# Altium project new.PrjPCB
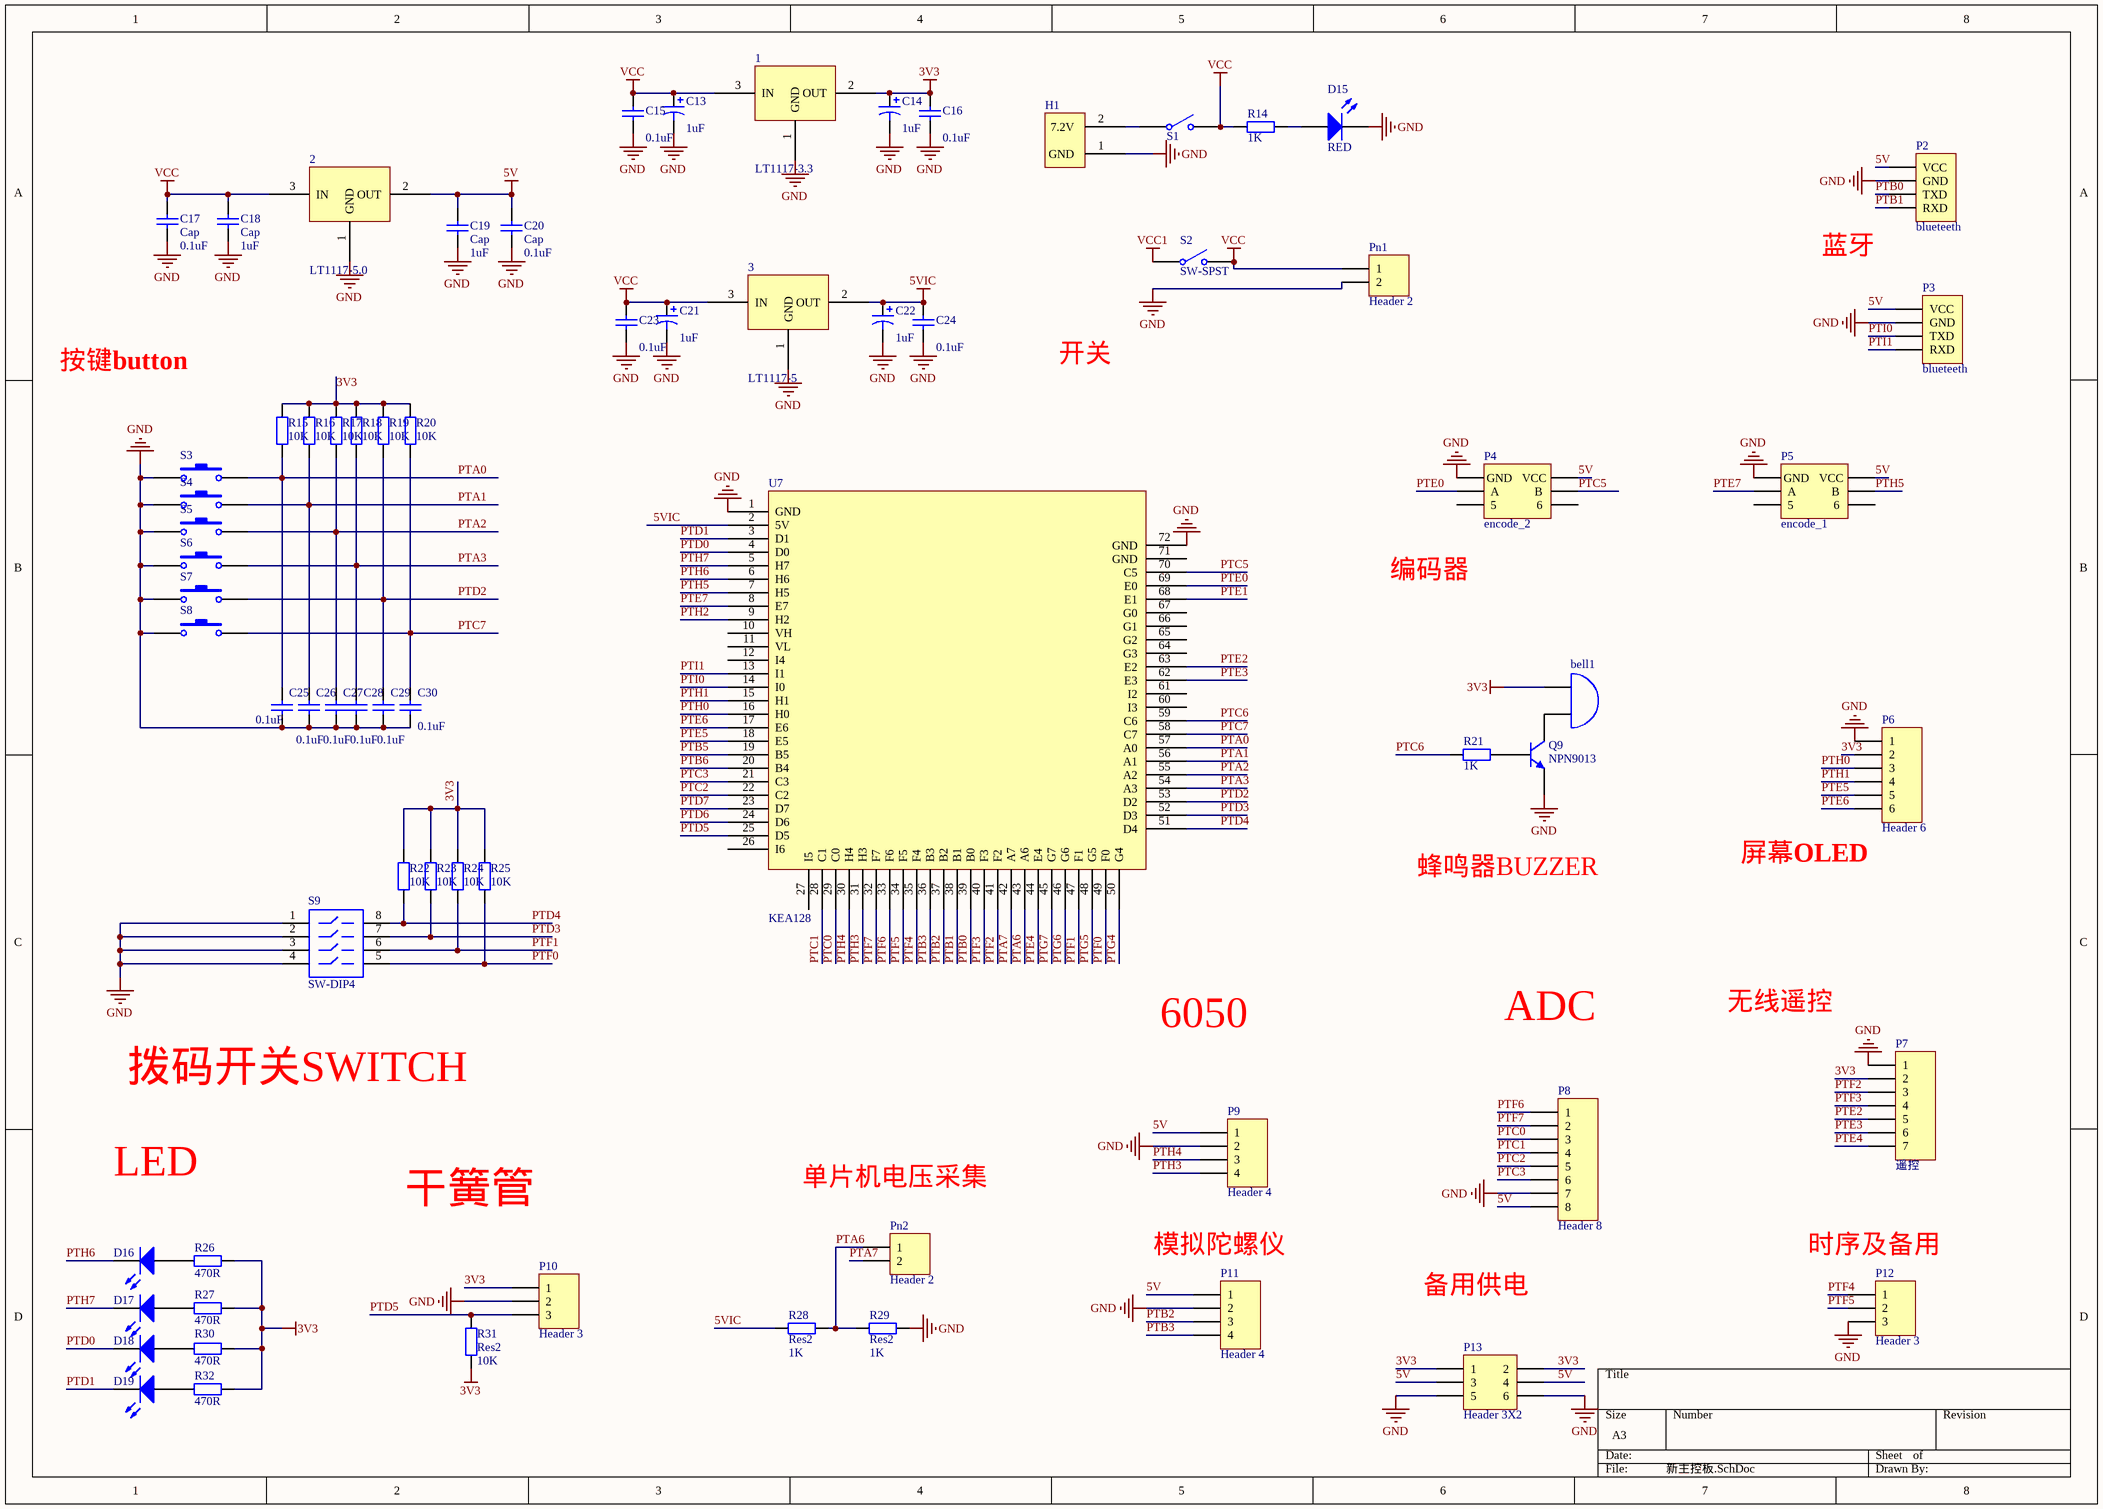
[diagram p0: 新主控板.SchDoc]
2 sheets, 128 parts. Net scope: global (net labels, ports and power ports of the same name join across sheets).
Board file: new.PcbDoc
Sheets:
  新主控板.SchDoc
  mos motor.SchDoc

## Sheet 新主控板.SchDoc
size A3

### Parts
1  LT1117-3.3  [1117]
2  LT1117-5.0  [1117]
3  LT1117-5  [1117]
bell1  Bell  [470uF]  (value not drawn)
C13  value 1uF  [0805(2012)]  (hidden comment: Cap Pol1)
C14  value 1uF  [0805(2012)]  (hidden comment: Cap Pol1)
C15  value 0.1uF  [0805(2012)]  (hidden comment: Cap)
C16  value 0.1uF  [0805(2012)]  (hidden comment: Cap)
C17  Cap  value 0.1uF  [0805(2012)]
C18  Cap  value 1uF  [0805(2012)]
C19  Cap  value 1uF  [0805(2012)]
C20  Cap  value 0.1uF  [0805(2012)]
C21  value 1uF  [0805(2012)]  (hidden comment: Cap Pol1)
C22  value 1uF  [0805(2012)]  (hidden comment: Cap Pol1)
C23  value 0.1uF  [0805(2012)]  (hidden comment: Cap)
C24  value 0.1uF  [0805(2012)]  (hidden comment: Cap)
C25  value 0.1uF  [0805(2012)]  (hidden comment: Cap)
C26  value 0.1uF  [0805(2012)]  (hidden comment: Cap)
C27  value 0.1uF  [0805(2012)]  (hidden comment: Cap)
C28  value 0.1uF  [0805(2012)]  (hidden comment: Cap)
C29  value 0.1uF  [0805(2012)]  (hidden comment: Cap)
C30  value 0.1uF  [0805(2012)]  (hidden comment: Cap)
D15  RED  [0805LED]
D16  LED0  [0805LED]  (value not drawn)
D17  LED0  [0805LED]  (value not drawn)
D18  LED0  [0805LED]  (value not drawn)
D19  LED0  [0805LED]  (value not drawn)
H1  H1  [KF301-2P]  (value not drawn)
P2  blueteeth  [HDR1X4]
P3  blueteeth  [HDR1X4]
P4  encode_2  [HDR2X3]
P5  encode_1  [HDR2X3]
P6  Header 6  [HDR1X6]
P7  遥控  [HDR1X7]
P8  Header 8  [HDR1X8]
P9  Header 4  [HDR1X4]
P10  Header 3  [HDR1X3]
P11  Header 4  [HDR1X4]
P12  Header 3  [HDR1X3]
P13  Header 3X2  [HDR2X3]
Pn1  Header 2  [HDR1X2]
Pn2  Header 2  [HDR1X2]
Q9  NPN9013  [TO-226-AE]
R14  value 1K  [0805(2012)]  (hidden comment: Res2)
R15  value 10K  [0805(2012)]  (hidden comment: Res2)
R16  value 10K  [0805(2012)]  (hidden comment: Res2)
R17  value 10K  [0805(2012)]  (hidden comment: Res2)
R18  value 10K  [0805(2012)]  (hidden comment: Res2)
R19  value 10K  [0805(2012)]  (hidden comment: Res2)
R20  value 10K  [0805(2012)]  (hidden comment: Res2)
R21  value 1K  [0805(2012)]  (hidden comment: Res2)
R22  value 10K  [0805(2012)]  (hidden comment: Res2)
R23  value 10K  [0805(2012)]  (hidden comment: Res2)
R24  value 10K  [0805(2012)]  (hidden comment: Res2)
R25  value 10K  [0805(2012)]  (hidden comment: Res2)
R26  value 470R  [0805(2012)]  (hidden comment: Res2)
R27  value 470R  [0805(2012)]  (hidden comment: Res2)
R28  Res2  value 1K  [0805(2012)]
R29  Res2  value 1K  [0805(2012)]
R30  value 470R  [0805(2012)]  (hidden comment: Res2)
R31  Res2  value 10K  [0805(2012)]
R32  value 470R  [0805(2012)]  (hidden comment: Res2)
S1  SW-SPST  [SWICH_3]  (value not drawn)
S2  SW-SPST  [SWICH_3]
S3  SW-PB  [PCBComponent_1]  (value not drawn)
S4  SW-PB  [PCBComponent_1]  (value not drawn)
S5  SW-PB  [PCBComponent_1]  (value not drawn)
S6  SW-PB  [PCBComponent_1]  (value not drawn)
S7  SW-PB  [PCBComponent_1]  (value not drawn)
S8  SW-PB  [PCBComponent_1]  (value not drawn)
S9  SW-DIP4  [DIP-8]
U7  KEA128  [KEA128_BOARD]

### Nets
3V3: 1.2(OUT) bell1.1(A) C14.1 C16.2 P6.2 P7.2 P10.1 P13.1 P13.2 R15.2 R16.2 R17.2 R18.2 R19.2 R20.2 R22.2 R23.2 R24.2 R25.2 R26.2 R27.2 R30.2 R31.1 R32.2
5V: 2.2(OUT) C19.2 C20.2 P2.1(VCC) P3.1(VCC) P4.2(VCC) P5.2(VCC) P8.8 P9.1 P11.1 P13.3 P13.4
5VIC: 3.2(OUT) C22.1 C24.2 R28.1 U7.2(5V)
GND: 1.1(GND) 2.1(GND) 3.1(GND) C13.2 C14.2 C15.1 C16.1 C17.1 C18.1 C19.1 C20.1 C21.2 C22.2 C23.1 C24.1 C25.1 C26.1 C27.1 C28.1 C29.1 C30.1 D15.2(K) H1.1(GND) P2.2(GND) P3.2(GND) P4.1(GND) P5.1(GND) P6.1 P7.1 P8.7 P9.2 P10.2 P11.2 P12.3 P13.5 P13.6 Pn1.2 Q9.1(E) R29.2 S3.1 S4.1 S5.1 S6.1 S7.1 S8.1 S9.1 S9.2 S9.3 S9.4 U7.1(GND) U7.72(GND)
VCC: 1.3(IN) 2.3(IN) 3.3(IN) C13.1 C15.2 C17.2 C18.2 C21.1 C23.2 Pn1.1 R14.2 S1.2(NO) S2.2(NO)
VCC1: S2.1(COMMON)  [project net Vbat]
PTA0: C25.2 R15.1 S3.2 U7.57(A0)
PTA1: C26.2 R16.1 S4.2 U7.56(A1)
PTA2: C27.2 R17.1 S5.2 U7.55(A2)
PTA3: C28.2 R18.1 S6.2 U7.54(A3)
PTA6: Pn2.1 R28.2 R29.1 U7.43(A6)
PTA7: Pn2.2 U7.42(A7)
PTB0: P2.3(TXD) U7.39(B0)
PTB1: P2.4(RXD) U7.38(B1)
PTB2: P11.3 U7.37(B2)
PTB3: P11.4 U7.36(B3)
PTB5: U7.19(B5)
PTB6: U7.20(B4)
PTC0: P8.3 U7.29(C0)
PTC1: P8.4 U7.28(C1)
PTC2: P8.5 U7.22(C2)
PTC3: P8.6 U7.21(C3)
PTC5: P4.4(B) U7.70(C5)
PTC6: R21.1 U7.59(C6)
PTC7: C30.2 R20.1 S8.2 U7.58(C7)
PTD0: D18.2(K) U7.4(D0)
PTD1: D19.2(K) U7.3(D1)
PTD2: C29.2 R19.1 S7.2 U7.53(D2)
PTD3: R23.1 S9.7 U7.52(D3)
PTD4: R22.1 S9.8 U7.51(D4)
PTD5: P10.3 R31.2 U7.25(D5)
PTD6: U7.24(D6)
PTD7: U7.23(D7)
PTE0: P4.3(A) U7.69(E0)
PTE1: U7.68(E1)
PTE2: P7.5 U7.63(E2)
PTE3: P7.6 U7.62(E3)
PTE4: P7.7 U7.44(E4)
PTE5: P6.5 U7.18(E5)
PTE6: P6.6 U7.17(E6)
PTE7: P5.3(A) U7.8(E7)
PTF0: R25.1 S9.5 U7.49(F0)
PTF1: R24.1 S9.6 U7.47(F1)
PTF2: P7.3 U7.41(F2)
PTF3: P7.4 U7.40(F3)
PTF4: P12.1 U7.35(F4)
PTF5: P12.2 U7.34(F5)
PTF6: P8.1 U7.33(F6)
PTF7: P8.2 U7.32(F7)
PTG4: U7.50(G4)
PTG5: U7.48(G5)
PTG6: U7.46(G6)
PTG7: U7.45(G7)
PTH0: P6.3 U7.16(H0)
PTH1: P6.4 U7.15(H1)
PTH2: U7.9(H2)
PTH3: P9.4 U7.31(H3)
PTH4: P9.3 U7.30(H4)
PTH5: P5.4(B) U7.7(H5)
PTH6: D16.2(K) U7.6(H6)
PTH7: D17.2(K) U7.5(H7)
PTI0: P3.3(TXD) U7.14(I0)
PTI1: P3.4(RXD) U7.13(I1)
Netbell1_2: bell1.2(B) Q9.3(C)
NetD15_1: D15.1(A) R14.1
NetD16_1: D16.1(A) R26.1
NetD17_1: D17.1(A) R27.1
NetD18_1: D18.1(A) R30.1
NetD19_1: D19.1(A) R32.1
NetH1_2: H1.2(7.2V) S1.1(COMMON)
NetQ9_2: Q9.2(B) R21.2

Not connected (* = marked no-connect by the designer): P4 5 6; P5 5 6; U7 10(VH) 11(VL) 12(I4) 26(I6) 27(I5) 60(I3) 61(I2) 64(G3) 65(G2) 66(G1) 67(G0) 71(GND)

### Notes on the sheet
- 蓝牙
- 按键button
- 开关
- 编码器
- 蜂鸣器BUZZER
- 屏幕OLED
- 6050
- ADC
- 无线遥控
- 拨码开关SWITCH
- LED
- 单片机电压采集
- 干簧管
- (near P11) 模拟陀螺仪
- (near P12) 时序及备用
- 备用供电

### Library data of the parts
2 3 = LT1117-3.3
bell1 = Bell: Electrical Bell; Published: 24-Mar-1999; LatestRevisionDate: 17-Jul-2002; LatestRevisionNote: Re-released for DXP Platform.; PackageReference: PIN2; Publisher: Altium Limited
C13 C14 C21 C22 = Cap Pol1: Polarized Capacitor (Radial); Published: 8-Jun-2000; LatestRevisionDate: 17-Jul-2002; LatestRevisionNote: Re-released for DXP Platform.; PackageReference: RB7.6-15; Publisher: Altium Limited; PackageDescription: Polarized Capacitor (Radial); 2 Leads
C15-C20 C23-C30 = Cap: Capacitor; Published: 8-Jun-2000; LatestRevisionDate: 17-Jul-2002; LatestRevisionNote: Re-released for DXP Platform.; PackageReference: RAD-0.3; Publisher: Altium Limited; PackageDescription: Radial Cap, Thru-Hole; 2 Leads; 0.3 in Pin Spacing
D15 = LED2: Typical RED, GREEN, YELLOW, AMBER GaAs LED; Published: 8-Jun-2000; LatestRevisionDate: 17-Jul-2002; LatestRevisionNote: Re-released for DXP Platform.; PackageVersion: Feb-2002; PackageReference: 3.2X1.6X1.1; Publisher: Altium Limited; PackageDescription: SM LED; 2 Flat Leads
D16-D19 = LED0: Typical INFRARED GaAs LED; Published: 8-Jun-2000; LatestRevisionDate: 08-Jul-2005; LatestRevisionNote: Mech Layer 1 removed.; PackageReference: LED-0; Publisher: Altium Limited; PackageDescription: LED; 2 Leads
P4 P5 = encode
P6 = Header 6: Header, 6-Pin; LatestRevisionDate: 17-Jul-2002; LatestRevisionNote: Re-released for DXP Platform.; Publisher: Altium Limited
P7 = MHDR1X7: Header, 7-Pin; LatestRevisionDate: 17-Jul-2002; LatestRevisionNote: Re-released for DXP Platform.; Publisher: Altium Limited
P8 = Header 8: Header, 8-Pin; LatestRevisionDate: 17-Jul-2002; LatestRevisionNote: Re-released for DXP Platform.; Publisher: Altium Limited
P9 P11 = Header 4: Header, 4-Pin; LatestRevisionDate: 17-Jul-2002; LatestRevisionNote: Re-released for DXP Platform.; Publisher: Altium Limited
P10 P12 = Header 3: Header, 3-Pin; LatestRevisionDate: 17-Jul-2002; LatestRevisionNote: Re-released for DXP Platform.; Publisher: Altium Limited
P13 = Header 3X2: Header, 3-Pin, Dual row; LatestRevisionDate: 17-Jul-2002; LatestRevisionNote: Re-released for DXP Platform.; Publisher: Altium Limited
Pn1 Pn2 = Header 2: Header, 2-Pin; LatestRevisionDate: 17-Jul-2002; LatestRevisionNote: Re-released for DXP Platform.; Publisher: Altium Limited
Q9 = 2N3904: NPN General Purpose Amplifier; Published: 8-Jun-2000; LatestRevisionDate: 15-Jan-2003; LatestRevisionNote: PCB Footprint 'BCY-W3/D4.7' replaced; DatasheetVersion: 1997; PackageVersion: Sep-1998; PackageReference: TO-92A; Publisher: Altium Limited; PackageDescription: TO, Flat Index; 3 In-Line, Axial Leads; Body Dia. 4.5mm; Leads 0.51 x 0.48 mm (max); ComponentLink1Description: Manufacturer Link; ComponentLink1URL: http://www.fairchildsemi.com/; ComponentLink2Description: Datasheet; ComponentLink2URL: http://www.fairchildsemi.com/ds/2N%2F2N3904.pdf
R14-R32 = Res2: Resistor; Published: 8-Jun-2000; LatestRevisionDate: 17-Jul-2002; LatestRevisionNote: Re-released for DXP Platform.; PackageReference: AXIAL-0.4; Publisher: Altium Limited; PackageDescription: Axial Device, Thru-Hole; 2 Leads; 0.4 in Pin Spacing
S1 S2 = SW-SPST: Single-Pole, Single-Throw Switch; Published: 24-Mar-1999; LatestRevisionDate: 17-Jul-2002; LatestRevisionNote: Re-released for DXP Platform.; PackageReference: SPST-2; Publisher: Altium Limited; PackageDescription: Switch; 2 Leads
S3-S8 = SW-PB: Switch; Published: 24-Mar-1999; LatestRevisionDate: 17-Jul-2002; LatestRevisionNote: Re-released for DXP Platform.; PackageReference: SPST-2; Publisher: Altium Limited; PackageDescription: Switch; 2 Leads
S9 = SW-DIP4: DIP Switch; Published: 24-Mar-1999; LatestRevisionDate: 17-Jul-2002; LatestRevisionNote: Re-released for DXP Platform.; PackageReference: DIP-8; Publisher: Altium Limited

## Sheet mos motor.SchDoc
size A3
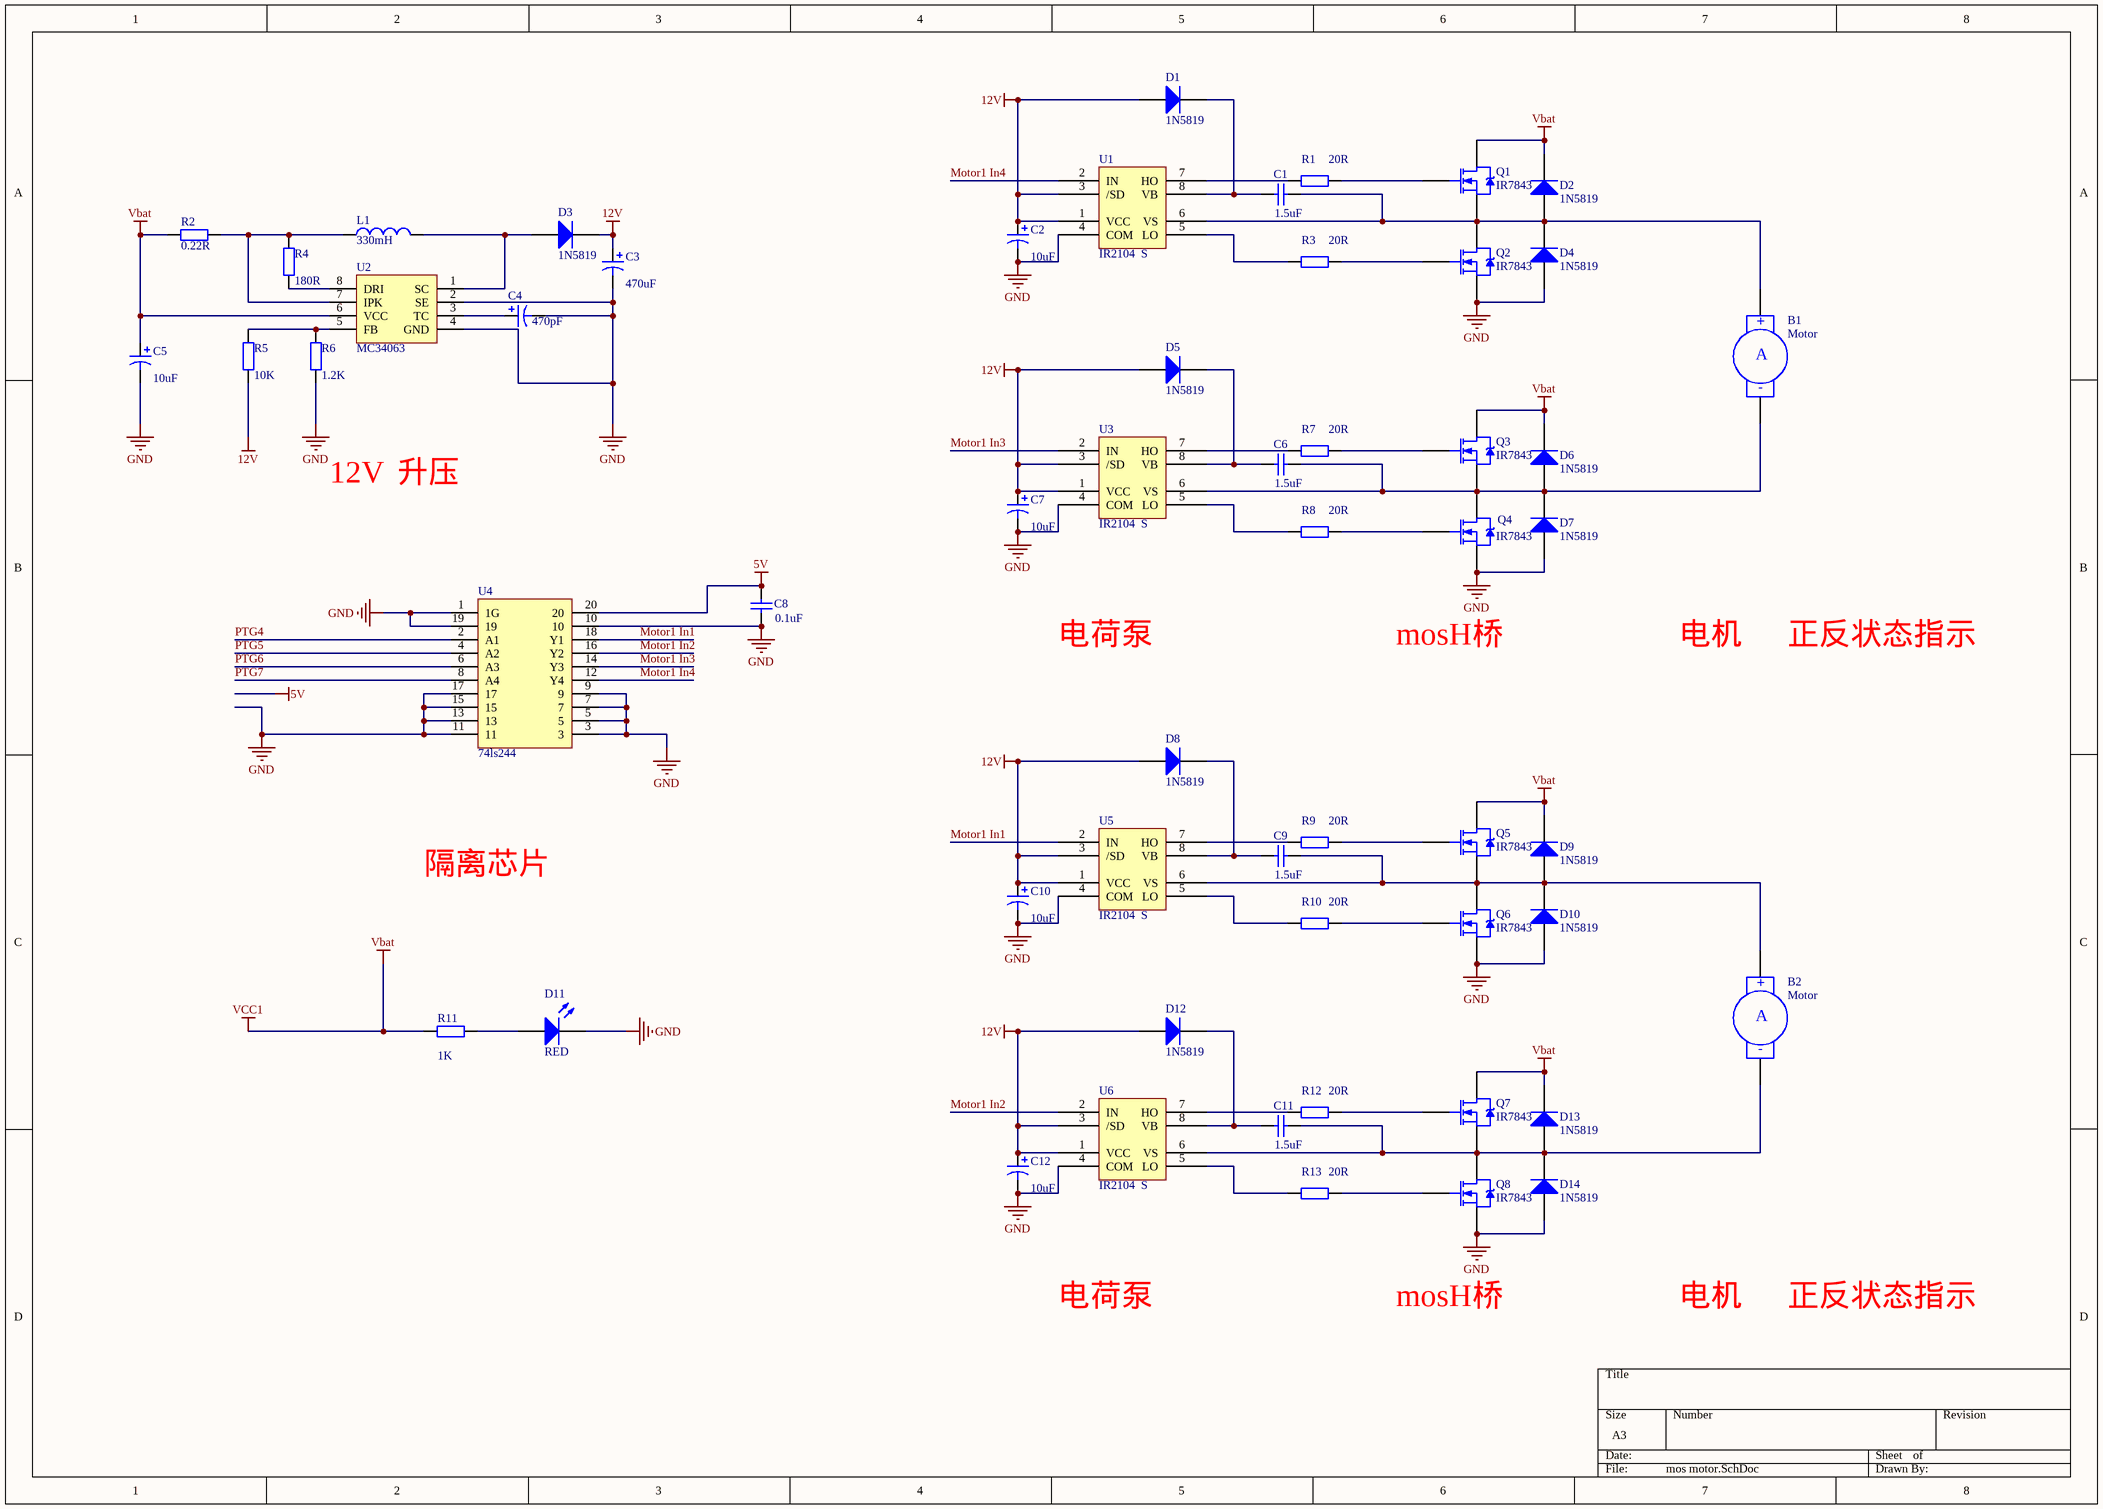
[diagram p1: mos motor.SchDoc]

### Parts
B1  Motor  [KF301-2P]
B2  Motor  [KF301-2P]
C1  value 1.5uF  [0805(2012)]  (hidden comment: Cap)
C2  value 10uF  [SOD-323(0805)]  (hidden comment: Cap Pol1)
C3  value 470uF  [RB5-10.5]  (hidden comment: Cap Pol1)
C4  value 470pF  [SOD-323(0805)]  (hidden comment: Cap Pol1)
C5  value 10uF  [SOD-323(0805)]  (hidden comment: Cap Pol1)
C6  value 1.5uF  [0805(2012)]  (hidden comment: Cap)
C7  value 10uF  [SOD-323(0805)]  (hidden comment: Cap Pol1)
C8  value 0.1uF  [0805(2012)]  (hidden comment: Cap)
C9  value 1.5uF  [0805(2012)]  (hidden comment: Cap)
C10  value 10uF  [SOD-323(0805)]  (hidden comment: Cap Pol1)
C11  value 1.5uF  [0805(2012)]  (hidden comment: Cap)
C12  value 10uF  [SOD-323(0805)]  (hidden comment: Cap Pol1)
D1  1N5819  [0805(2012)]
D2  1N5819  [0805(2012)]
D3  1N5819  [0805(2012)]
D4  1N5819  [0805(2012)]
D5  1N5819  [0805(2012)]
D6  1N5819  [0805(2012)]
D7  1N5819  [0805(2012)]
D8  1N5819  [0805(2012)]
D9  1N5819  [0805(2012)]
D10  1N5819  [0805(2012)]
D11  RED  [0805LED]
D12  1N5819  [0805(2012)]
D13  1N5819  [0805(2012)]
D14  1N5819  [0805(2012)]
L1  value 330mH  [电感10*12]  (hidden comment: Inductor)
Q1  IR7843  [LR7843]
Q2  IR7843  [LR7843]
Q3  IR7843  [LR7843]
Q4  IR7843  [LR7843]
Q5  IR7843  [LR7843]
Q6  IR7843  [LR7843]
Q7  IR7843  [LR7843]
Q8  IR7843  [LR7843]
R1  value 20R  [0805(2012)]  (hidden comment: Res2)
R2  value 0.22R  [1206(3216)]  (hidden comment: Res2)
R3  value 20R  [0805(2012)]  (hidden comment: Res2)
R4  value 180R  [0805(2012)]  (hidden comment: Res2)
R5  value 10K  [0805(2012)]  (hidden comment: Res2)
R6  value 1.2K  [0805(2012)]  (hidden comment: Res2)
R7  value 20R  [0805(2012)]  (hidden comment: Res2)
R8  value 20R  [0805(2012)]  (hidden comment: Res2)
R9  value 20R  [0805(2012)]  (hidden comment: Res2)
R10  value 20R  [0805(2012)]  (hidden comment: Res2)
R11  value 1K  [0805(2012)]  (hidden comment: Res2)
R12  value 20R  [0805(2012)]  (hidden comment: Res2)
R13  value 20R  [0805(2012)]  (hidden comment: Res2)
U1  IR2104  S  [IR2104S]
U2  MC34063  [MC34063]
U3  IR2104  S  [IR2104S]
U4  74ls244  [74ls244Da]
U5  IR2104  S  [IR2104S]
U6  IR2104  S  [IR2104S]

### Nets
5V: C8.2 U4.20
12V: C2.1 C3.1 C7.1 C10.1 C12.1 D1.2(A) D3.1(K) D5.2(A) D8.2(A) D12.2(A) R5.1 U1.1(VCC) U1.3(/SD) U3.1(VCC) U3.3(/SD) U5.1(VCC) U5.3(/SD) U6.1(VCC) U6.3(/SD)
GND: C2.2 C3.2 C4.2 C5.2 C7.2 C8.1 C10.2 C12.2 D4.2(A) D7.2(A) D10.2(A) D11.2(K) D14.2(A) Q2.3(S) Q4.3(S) Q6.3(S) Q8.3(S) R6.1 U1.4(COM) U2.2(SE) U2.4(GND) U3.4(COM) U4.1(1G) U4.3 U4.5 U4.7 U4.9 U4.10 U4.11 U4.13 U4.15 U4.17 U4.19 U5.4(COM) U6.4(COM)
Vbat: C5.1 D2.1(K) D6.1(K) D9.1(K) D13.1(K) Q1.2(D) Q3.2(D) Q5.2(D) Q7.2(D) R2.2 R11.1 U2.6(VCC)  [also labelled VCC1]
Motor1 In1: U4.18(Y1) U5.2(IN)
Motor1 In2: U4.16(Y2) U6.2(IN)
Motor1 In3: U3.2(IN) U4.14(Y3)
Motor1 In4: U1.2(IN) U4.12(Y4)
PTG4: U4.2(A1)
PTG5: U4.4(A2)
PTG6: U4.6(A3)
PTG7: U4.8(A4)
NetB1_1: B1.1(+) C1.2 D2.2(A) D4.1(K) Q1.3(S) Q2.2(D) U1.6(VS)
NetB1_2: B1.2(-) C6.2 D6.2(A) D7.1(K) Q3.3(S) Q4.2(D) U3.6(VS)
NetB2_1: B2.1(+) C9.2 D9.2(A) D10.1(K) Q5.3(S) Q6.2(D) U5.6(VS)
NetB2_2: B2.2(-) C11.2 D13.2(A) D14.1(K) Q7.3(S) Q8.2(D) U6.6(VS)
NetC1_1: C1.1 D1.1(K) U1.8(VB)
NetC4_1: C4.1 U2.3(TC)
NetC6_1: C6.1 D5.1(K) U3.8(VB)
NetC9_1: C9.1 D8.1(K) U5.8(VB)
NetC11_1: C11.1 D12.1(K) U6.8(VB)
NetD3_2: D3.2(A) L1.2 U2.1(SC)
NetD11_1: D11.1(A) R11.2
NetL1_1: L1.1 R2.1 R4.2 U2.7(IPK)
NetQ1_1: Q1.1(G) R1.2
NetQ2_1: Q2.1(G) R3.2
NetQ3_1: Q3.1(G) R7.2
NetQ4_1: Q4.1(G) R8.2
NetQ5_1: Q5.1(G) R9.2
NetQ6_1: Q6.1(G) R10.2
NetQ7_1: Q7.1(G) R12.2
NetQ8_1: Q8.1(G) R13.2
NetR1_1: R1.1 U1.7(HO)
NetR3_1: R3.1 U1.5(LO)
NetR4_1: R4.1 U2.8(DRI)
NetR5_2: R5.2 R6.2 U2.5(FB)
NetR7_1: R7.1 U3.7(HO)
NetR8_1: R8.1 U3.5(LO)
NetR9_1: R9.1 U5.7(HO)
NetR10_1: R10.1 U5.5(LO)
NetR12_1: R12.1 U6.7(HO)
NetR13_1: R13.1 U6.5(LO)

### Notes on the sheet
- 12V
- 升压
- 电荷泵
- mosH桥
- 电机
- 正反状态指示
- 隔离芯片
- (in symbol Motor Servo) A

### Library data of the parts
B1 B2 = Motor Servo: Servo Motor; Published: 24-Mar-1999; LatestRevisionDate: 17-Jul-2002; LatestRevisionNote: Re-released for DXP Platform.; PackageReference: RAD-0.4; Publisher: Altium Limited; PackageDescription: Radial Cap, Thru-Hole; 2 Leads; 0.4 in Pin Spacing
C1 C6 C8 C9 C11 = Cap: Capacitor; Published: 8-Jun-2000; LatestRevisionDate: 17-Jul-2002; LatestRevisionNote: Re-released for DXP Platform.; PackageReference: RAD-0.3; Publisher: Altium Limited; PackageDescription: Radial Cap, Thru-Hole; 2 Leads; 0.3 in Pin Spacing
C2-C5 C7 C10 C12 = Cap Pol1: Polarized Capacitor (Radial); Published: 8-Jun-2000; LatestRevisionDate: 17-Jul-2002; LatestRevisionNote: Re-released for DXP Platform.; PackageReference: RB7.6-15; Publisher: Altium Limited; PackageDescription: Polarized Capacitor (Radial); 2 Leads
D1-D10 D12-D14 = 1N4148: Silicon Epitaxial Planar Diode for Various Detector, Modulator, Demodulator; Published: 12-Feb-2010; DatasheetVersion: Rev.5.00, Jul-2006; PackageVersion: Aug-2005; PackageReference: GRZZ0002ZB-A; Publisher: Altium Limited; PackageDescription: Diode, Axial; Body 4.2 x 2.0 mm (LxDia.), Lead Dia. 0.5 mm (nom); Code_JEITA: SC-40; ComponentLink1Description: Manufacturer Link; ComponentLink1URL: http://sg.renesas.com/fmwk.jsp?cnt=diode_landing.jsp&fp=/products/discrete/diodes/; ComponentLink2Description: Datasheet; ComponentLink2URL: http://documentation.renesas.com/eng/products/diode/rej03g0556_1n4148.pdf; ComponentLink3Description: Packaging Specification; ComponentLink3URL: http://sg.renesas.com/media/products/common_info/package/pdf/diode/code/grzz0002zb_a.pdf
D11 = LED2: as D15 on sheet 新主控板; Published: 8-Jun-2000; LatestRevisionDate: 17-Jul-2002; LatestRevisionNote: Re-released for DXP Platform.; PackageVersion: Feb-2002; PackageReference: 3.2X1.6X1.1; Publisher: Altium Limited; PackageDescription: SM LED; 2 Flat Leads
L1 = Inductor: Code_IEC: 1005; Published: 8-Jun-2000; LatestRevisionDate: 29-May-2009; LatestRevisionNote: IPC-7351 Footprint Added.; PackageReference: 0402-A; Publisher: Altium Limited; PackageDescription: Chip Inductor; Code_JEITA: 0402
Q1-Q8 = IR7843: N-Channel Power MOSFET; Note: Pin 2 is electrically connected to pin 4.; Published: 8-Jun-2000; LatestRevisionDate: 17-Jul-2002; LatestRevisionNote: Re-released for DXP Platform.; DatasheetVersion: PD-9.814; PackageVersion: Feb-1997; PackageReference: TO-220AB; Publisher: Altium Limited; PackageDescription: TO, Thru-Hole, Vertical, Heatsink Mounted; 3 In-Line Leads; Pitch 2.54 mm; ComponentLink1Description: Manufacturer Link; ComponentLink1URL: http://www.irf.com/
R1-R13 = Res2: Resistor; Published: 8-Jun-2000; LatestRevisionDate: 17-Jul-2002; LatestRevisionNote: Re-released for DXP Platform.; PackageReference: AXIAL-0.4; Publisher: Altium Limited; PackageDescription: Axial Device, Thru-Hole; 2 Leads; 0.4 in Pin Spacing
U2 = Component_1

## Nets that join several sheets
5V: 新主控板 (12 pins), mos motor (C8.2 U4.20)
GND: 新主控板 (51 pins), mos motor (35 pins)
Vbat: 新主控板 (S2.1), mos motor (12 pins)
PTG4: 新主控板 (U7.50), mos motor (U4.2)
PTG5: 新主控板 (U7.48), mos motor (U4.4)
PTG6: 新主控板 (U7.46), mos motor (U4.6)
PTG7: 新主控板 (U7.45), mos motor (U4.8)